# EAGLE design OP-80A (EAGLE 6.6.0)
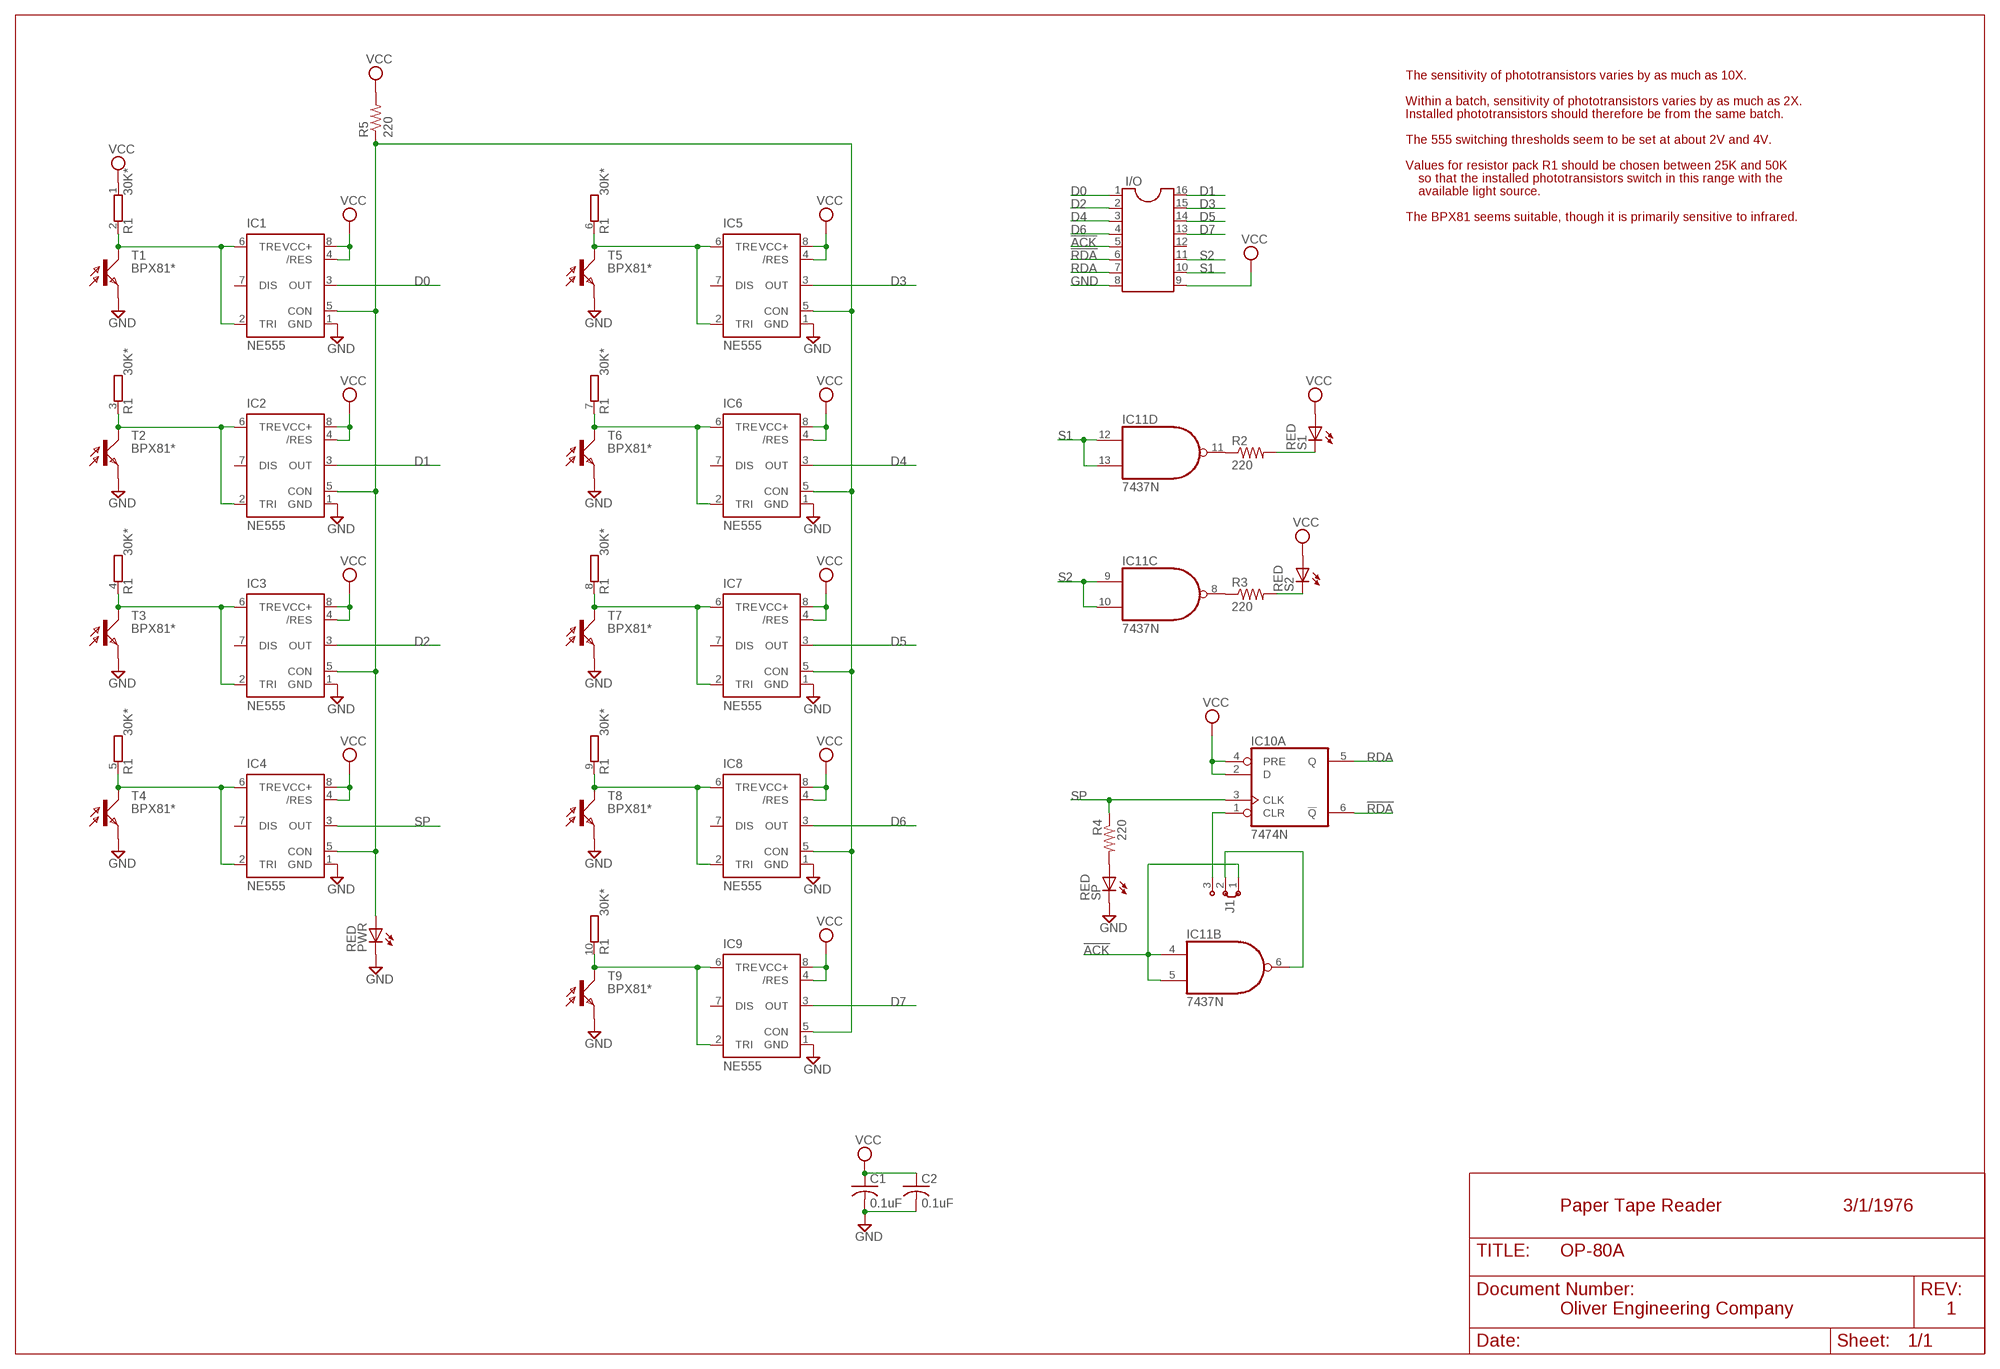
[diagram p0: schematic, sheet 1]

## Parts
C1  0.1uF  C-US050-030X075  [C050-030X075]
C2  0.1uF  C-US050-030X075  [C050-030X075]
I/O  DIL16S  [SOCKET-16]
IC1  NE555  [DIL-08]
IC2  NE555  [DIL-08]
IC3  NE555  [DIL-08]
IC4  NE555  [DIL-08]
IC5  NE555  [DIL-08]
IC6  NE555  [DIL-08]
IC7  NE555  [DIL-08]
IC8  NE555  [DIL-08]
IC9  NE555  [DIL-08]
IC10  7474N  74LS74N  [DIL14]
IC11  7437N  [DIL14]
J1  J2X5MM  [05C]
PWR  RED  LED5MM  [LED5MM]
R1  30K*  GE09RP  [SIL10]
R2  220  R-US_0207/10  [0207/10]
R3  220  R-US_0207/10  [0207/10]
R4  220  R-US_0207/10  [0207/10]
R5  220  R-US_0207/10  [0207/10]
S1  RED  LED5MM  [LED5MM]
S2  RED  LED5MM  [LED5MM]
SP  RED  LED5MM  [LED5MM]
T1  BPX81*  BPX81  [BPX81]
T2  BPX81*  BPX81  [BPX81]
T3  BPX81*  BPX81  [BPX81]
T4  BPX81*  BPX81  [BPX81]
T5  BPX81*  BPX81  [BPX81]
T6  BPX81*  BPX81  [BPX81]
T7  BPX81*  BPX81  [BPX81]
T8  BPX81*  BPX81  [BPX81]
T9  BPX81*  BPX81  [BPX81]

## Nets
!ACK: I/O.5 IC11.4(B:I0) IC11.5(B:I1) J1.1
!RDA: I/O.6 IC10.6(A:!Q)
ACK: IC11.6(B:O) J1.2
D0: I/O.1 IC1.3(OUT)
D1: I/O.16 IC2.3(OUT)
D2: I/O.2 IC3.3(OUT)
D3: I/O.15 IC5.3(OUT)
D4: I/O.3 IC6.3(OUT)
D5: I/O.14 IC7.3(OUT)
D6: I/O.4 IC8.3(OUT)
D7: I/O.13 IC9.3(OUT)
GND [supply]: C1.2 C2.2 I/O.8 IC1.1(GND) IC2.1(GND) IC3.1(GND) IC4.1(GND) IC5.1(GND) IC6.1(GND) IC7.1(GND) IC8.1(GND) IC9.1(GND) PWR.K(C) SP.K(C) T1.E T2.E T3.E T4.E T5.E T6.E T7.E T8.E T9.E
N$1: IC1.2(TRI) IC1.6(TRE) R1.2 T1.C
N$2: R4.2 SP.A
N$3: IC1.5(CON) IC2.5(CON) IC3.5(CON) IC4.5(CON) IC5.5(CON) IC6.5(CON) IC7.5(CON) IC8.5(CON) IC9.5(CON) PWR.A R5.1
N$4: IC2.2(TRI) IC2.6(TRE) R1.3 T2.C
N$7: IC3.2(TRI) IC3.6(TRE) R1.4 T3.C
N$8: IC11.11(D:O) R2.1
N$9: IC9.2(TRI) IC9.6(TRE) R1.10 T9.C
N$10: IC4.2(TRI) IC4.6(TRE) R1.5 T4.C
N$11: IC11.8(C:O) R3.1
N$12: R2.2 S1.K(C)
N$13: IC5.2(TRI) IC5.6(TRE) R1.6 T5.C
N$14: R3.2 S2.K(C)
N$15: IC6.2(TRI) IC6.6(TRE) R1.7 T6.C
N$17: IC7.2(TRI) IC7.6(TRE) R1.8 T7.C
N$19: IC8.2(TRI) IC8.6(TRE) R1.9 T8.C
RDA: I/O.7 IC10.5(A:Q)
S1: I/O.10 IC11.12(D:I0) IC11.13(D:I1)
S2: I/O.11 IC11.9(C:I0) IC11.10(C:I1)
SACK: IC10.1(A:CLR) J1.3
SP: IC4.3(OUT) IC10.3(A:CLK) R4.1
VCC [supply]: C1.1 C2.1 I/O.9 IC1.4(/RES) IC1.8(VCC+) IC2.4(/RES) IC2.8(VCC+) IC3.4(/RES) IC3.8(VCC+) IC4.4(/RES) IC4.8(VCC+) IC5.4(/RES) IC5.8(VCC+) IC6.4(/RES) IC6.8(VCC+) IC7.4(/RES) IC7.8(VCC+) IC8.4(/RES) IC8.8(VCC+) IC9.4(/RES) IC9.8(VCC+) IC10.2(A:D) IC10.4(A:PRE) R1.1 R5.2 S1.A S2.A
Unconnected: I/O.12 IC1.7(DIS) IC2.7(DIS) IC3.7(DIS) IC4.7(DIS) IC5.7(DIS) IC6.7(DIS) IC7.7(DIS) IC8.7(DIS) IC9.7(DIS) IC10.8(B:!Q) IC10.9(B:Q) IC10.10(B:PRE) IC10.11(B:CLK) IC10.12(B:D) IC10.13(B:CLR) IC11.1(A:I0) IC11.2(A:I1) IC11.3(A:O)

## Notes on the sheet
- The sensitivity of phototransistors varies by as much as 10X.
- Within a batch, sensitivity of phototransistors varies by as much as 2X.
- Installed phototransistors should therefore be from the same batch.
- The 555 switching thresholds seem to be set at about 2V and 4V.
- Values for resistor pack R1 should be chosen between 25K and 50K
- so that the installed phototransistors switch in this range with the
- available light source.
- The BPX81 seems suitable, though it is primarily sensitive to infrared.
- Paper Tape Reader | 3/1/1976
- Oliver Engineering Company | 1

## Power pins joined to a net without a drawn wire
GND: IC10.7(P:GND) IC11.7(P:GND)
VCC: IC10.14(P:VCC) IC11.14(P:VCC)

## Library data of the parts
C1 C2 = rcl:C-US: CAPACITOR, American symbol
I/O = ic-package:DIL16: Dual In Line / Socket
IC1-IC9 = st-microelectronics:NE555: General purpose bipolar Timer; MF: Arrow Electronics; MPN: NE555N; OC_FARNELL: 1467742; OC_NEWARK: 89K1486
IC10 = 74xx-eu:74*74: Dual D type positive edge triggered FLIP FLOP, preset and clear
IC11 = 74xx-us:74*37: Quad 2-input NAND buffer
J1 = jumper:J2: Jumper switch 2 x 2.5 mm
PWR S1 S2 SP = led:LED: LED OSRAM: - CHIPLED LG R971, LG N971, LY N971, LG Q971, LY Q971, LO R971, LY R971 LH N974, LH R974 LS Q976, LO Q976, LY Q976 LO Q996 - Hyper CHIPLED LW Q18S LB Q993, LB Q99A, LB R99A - SideLED LS A670, LO A670, LY A670, LG A670, LP A670 LB A673, LV A673, LT A673, LW A673 LH A674 LY A675 LS A676, LA A676, LO A676, LY A676, LW A676 LS A679, LY A679, LG A679 - Hyper Micro SIDELED® LS Y876, LA Y876, LO Y876, LY Y876 LT Y87S - SmartLED LW L88C, LW L88S LB L89C, LB L89S, LG L890 LS L89K, LO L89K, LY L89K LS L896, LA L896, LO L896, LY L896 - TOPLED LS T670, LO T670, LY T670, LG T670, LP T670 LSG T670, LSP T670, LSY T670, LOP T670, LYG T670 LG T671, LOG T671, LSG T671 LB T673, LV T673, LT T673, LW T673 LH T674 LS T676, LA T676, LO T676, LY T676, LB T676, LH T676, LSB T676, LW T676 LB T67C, LV T67C, LT T67C, LS T67K, LO T67K, LY T67K, LW E67C LS E67B, LA E67B, LO E67B, LY E67B, LB E67C, LV E67C, LT E67C LW T67C LS T679, LY T679, LG T679 LS T770, LO T770, LY T770, LG T770, LP T770 LB T773, LV T773, LT T773, LW T773 LH T774 LS E675, LA E675, LY E675, LS T675 LS T776, LA T776, LO T776, LY T776, LB T776 LHGB T686 LT T68C, LB T68C - Hyper Mini TOPLED® LB M676 - Mini TOPLED Santana® LG M470 LS M47K, LO M47K, LY M47K Source: http://www.osram.convergy.de LUXEON: - LUMILED® LXK2-PW12-R00, LXK2-PW12-S00, LXK2-PW14-U00, LXK2-PW14-V00 LXK2-PM12-R00, LXK2-PM12-S00, LXK2-PM14-U00 LXK2-PE12-Q00, LXK2-PE12-R00, LXK2-PE12-S00, LXK2-PE14-T00, LXK2-PE14-U00 LXK2-PB12-K00, LXK2-PB12-L00, LXK2-PB12-M00, LXK2-PB14-N00, LXK2-PB14-P00, LXK2-PB14-Q00 LXK2-PR12-L00, LXK2-PR12-M00, LXK2-PR14-Q00, LXK2-PR14-R00 LXK2-PD12-Q00, LXK2-PD12-R00, LXK2-PD12-S00 LXK2-PH12-R00, LXK2-PH12-S00 LXK2-PL12-P00, LXK2-PL12-Q00, LXK2-PL12-R00 Source: www.luxeon.com KINGBRIGHT: KA-3528ASYC Source: www.kingbright.com
R1 = resistor-sil:GE09RP: SIL RESISTOR; OC_FARNELL: unknown; OC_NEWARK: unknown
R2-R5 = rcl:R-US_: RESISTOR, American symbol
T1-T9 = opto-trans-siemens:BPX81: PHOTO TRANSISTOR; OC_FARNELL: unknown; OC_NEWARK: unknown

## Net classes
1 supply: width 0.61 mm

## Board
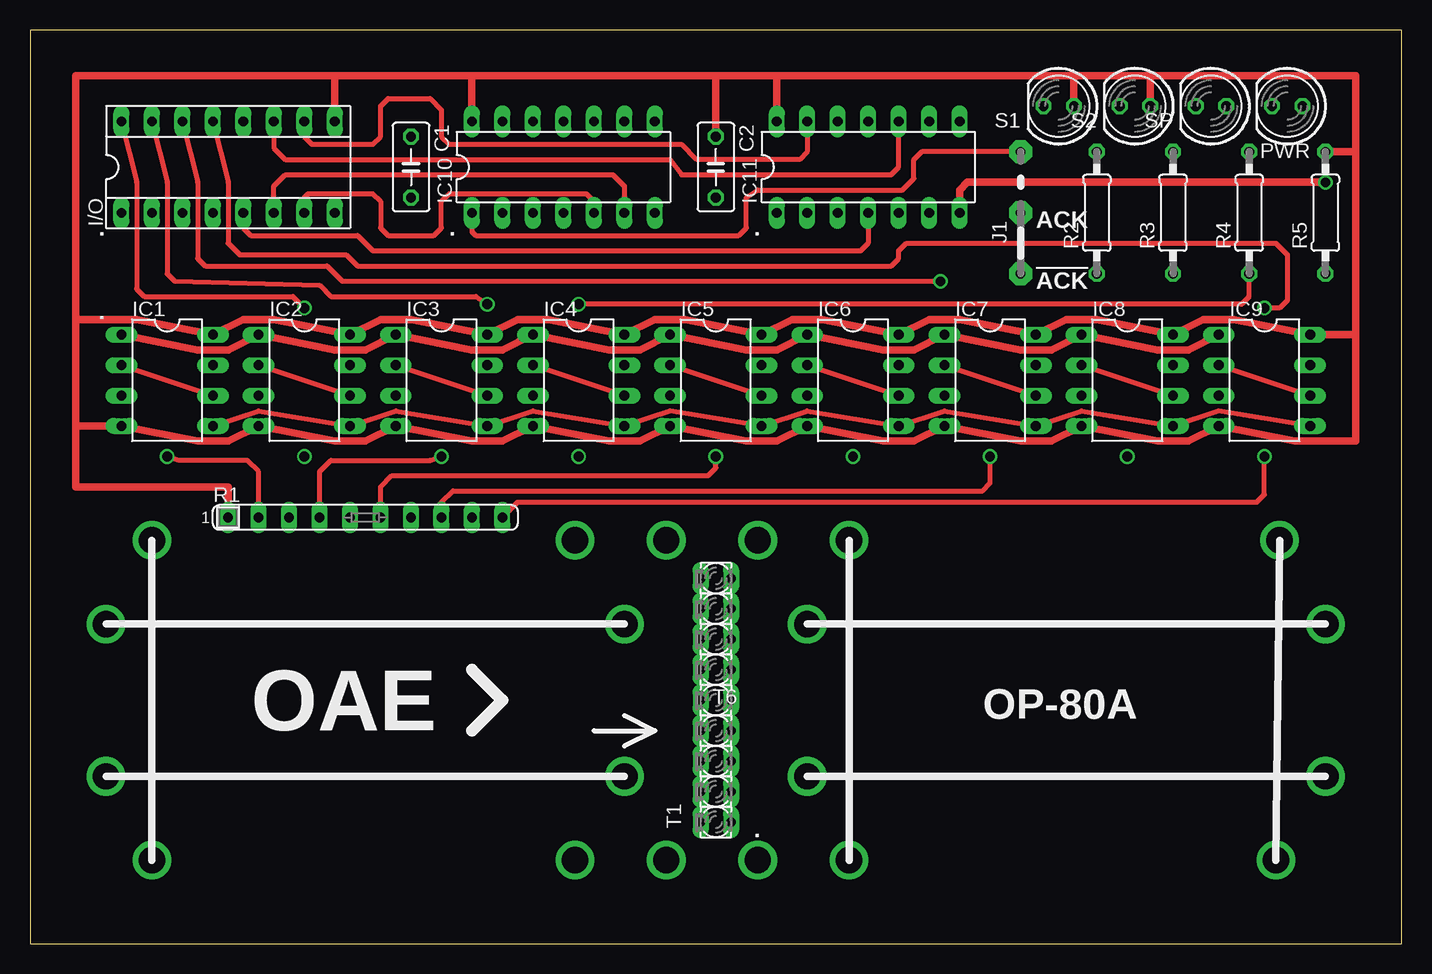
[diagram p1: board, top side]
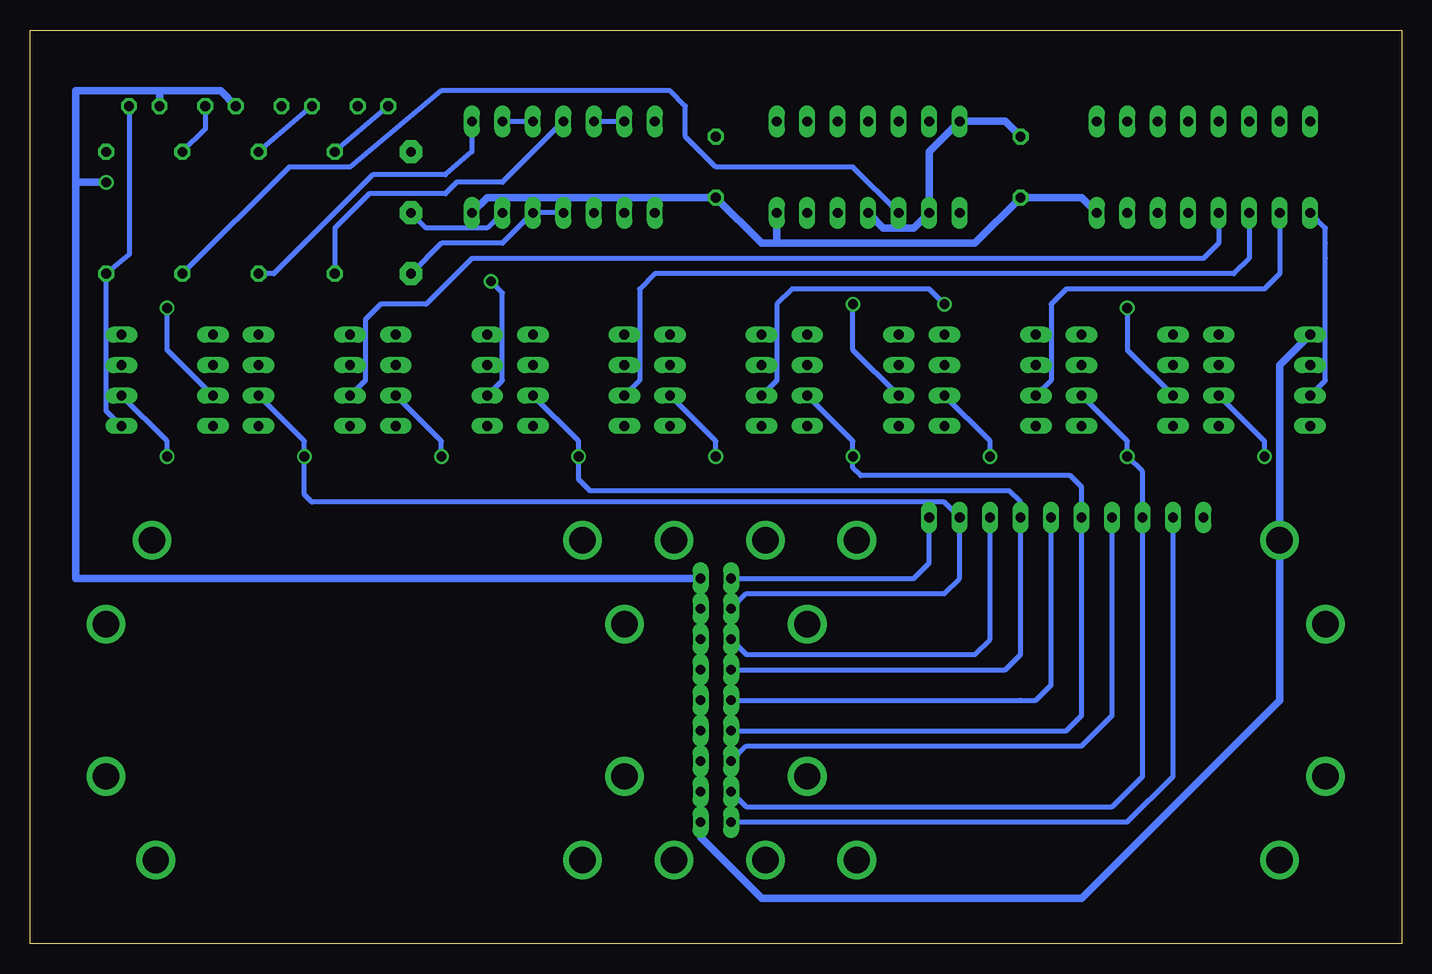
[diagram p2: board, bottom side, seen from below]

Size 114.3 x 76.2 mm. Coordinates in mm from the lower left corner, seen from the top.
Outline: 0,0 114.3,0 114.3,76.2 0,76.2 0,0
Copper layers (1+16): Top 0.035mm / dielectric 1.5mm / Bottom 0.035mm
Design rules "16mils *": minimum track width 16mil, minimum drill 32mil, track to track 15mil, track to pad 10mil, pad to pad 10mil, via to via 10mil, smd to smd 10mil, copper to edge 13mil, drill to drill 10mil, minimum pad ring 10mil, minimum via ring 8mil, stop-mask expansion 0mil, vias tented up to drill 0mil, thermal gap 10mil

### Footprints (pad centres in the part's own frame; a part is rotated, then mirrored left to right if it is on the bottom)
C050-030X075 = drill 0.813 octagon: 1 -2.54,0; 2 2.54,0
SOCKET-16 = drill 0.813 long: 1 -8.89,-3.81; 2 -6.35,-3.81; 3 -3.81,-3.81; 4 -1.27,-3.81; 5 1.27,-3.81; 6 3.81,-3.81; 7 6.35,-3.81; 8 8.89,-3.81; 9 8.89,3.81; 10 6.35,3.81; 11 3.81,3.81; 12 1.27,3.81; 13 -1.27,3.81; 14 -3.81,3.81; 15 -6.35,3.81; 16 -8.89,3.81
DIL-08 = drill 0.813 long: 1 -3.81,-3.81; 2 -1.27,-3.81; 3 1.27,-3.81; 4 3.81,-3.81; 5 3.81,3.81; 6 1.27,3.81; 7 -1.27,3.81; 8 -3.81,3.81
DIL14 = drill 0.813 long: 1 -7.62,-3.81; 2 -5.08,-3.81; 3 -2.54,-3.81; 4 0,-3.81; 5 2.54,-3.81; 6 5.08,-3.81; 7 7.62,-3.81; 8 7.62,3.81; 9 5.08,3.81; 10 2.54,3.81; 11 0,3.81; 12 -2.54,3.81; 13 -5.08,3.81; 14 -7.62,3.81
05C = drill 0.813 pad 1.905 octagon: 1 -2.54,0; 2 2.54,0; 3 7.62,0
LED5MM = drill 0.813 octagon: A -1.27,0; K 1.27,0
SIL10 = drill 0.813 long: 1 -11.43,0; 2 -8.89,0; 3 -6.35,0; 4 -3.81,0; 5 -1.27,0; 6 1.27,0; 7 3.81,0; 8 6.35,0; 9 8.89,0; 10 11.43,0
0207/10 = drill 0.813 octagon: 1 -5.08,0; 2 5.08,0
BPX81 = drill 0.813 long: C 1.27,0; E -1.27,0

### Placement (x,y rotation side)
C1  31.75,64.77 270 top
C2  57.15,64.77 270 top
I/O  16.51,64.77 0 top
IC1  11.43,46.99 270 top
IC2  22.86,46.99 270 top
IC3  34.29,46.99 270 top
IC4  45.72,46.99 270 top
IC5  57.15,46.99 270 top
IC6  68.58,46.99 270 top
IC7  80.01,46.99 270 top
IC8  91.44,46.99 270 top
IC9  102.87,46.99 270 top
IC10  44.45,64.77 0 top
IC11  69.85,64.77 0 top
J1  82.55,58.42 90 top
PWR  104.78,69.85 180 top
R1  27.94,35.56 0 top
R2  88.9,60.96 90 top
R3  95.25,60.96 90 top
R4  101.6,60.96 90 top
R5  107.95,60.96 90 top
S1  85.72,69.85 180 top
S2  92.08,69.85 180 top
SP  98.42,69.85 180 top
T1  57.15,10.16 180 top
T2  57.15,12.7 180 top
T3  57.15,15.24 180 top
T4  57.15,17.78 180 top
T5  57.15,20.32 180 top
T6  57.15,22.86 180 top
T7  57.15,25.4 180 top
T8  57.15,27.94 180 top
T9  57.15,30.48 180 top

### Tracks (layer width: path | path; a pad name or v marks a point on that pad's centre or on a via)
!ACK
  Top 0.406: I/O.5 17.78,59.69 18.41,59.05 27.3,59.05 28.57,57.78 69.22,57.78 69.85,58.42 IC11.4
  Bottom 0.406: IC11.4 IC11.5 74.93,58.42 80.01,58.42 J1.1
!RDA
  Top 0.406: I/O.6 20.32,63.18 21.27,64.14 48.58,64.14 49.53,63.18 IC10.6
ACK
  Bottom 0.406: IC11.6 76.2,59.69 81.28,59.69 J1.2
D0
  Bottom 0.406: IC1.3 6.35,46.99 6.35,57.15 6.35,58.42 6.35,59.69 I/O.1
D1  (via drill 0.81)
  Top 0.406: I/O.16 8.89,63.5 8.89,54.61 9.53,53.98 21.91,53.98 v22.86,53.02
  Bottom 0.406: IC2.3 22.86,49.53 v22.86,53.02
D2
  Bottom 0.406: I/O.2 10.16,55.88 11.43,54.61 27.94,54.61 29.21,53.34 29.21,46.99 IC3.3
D3  (via drill 0.81)
  Top 0.406: I/O.15 11.43,63.5 11.43,55.88 12.06,55.24 24.13,54.93 25.08,53.98 37.15,53.98 v38.1,53.34
  Bottom 0.406: v38.1,53.34 39.37,54.61 50.8,54.61 52.07,53.34 52.07,46.99 IC5.3
D4
  Bottom 0.406: I/O.3 12.7,57.15 13.97,55.88 62.23,55.88 63.5,54.61 63.5,46.99 IC6.3
D5  (via drill 0.81)
  Top 0.406: I/O.14 13.97,63.5 13.97,57.15 14.61,56.52 24.77,56.52 26.04,55.24 v75.88,55.24
  Bottom 0.406: IC7.3 74.93,46.99 74.93,54.29 v75.88,55.24
D6
  Bottom 0.406: I/O.4 15.24,58.42 16.51,57.15 77.47,57.15 81.28,53.34 85.09,53.34 86.36,52.07 86.36,46.99 IC8.3
D7  (via drill 0.81)
  Top 0.406: I/O.13 16.51,63.5 16.51,58.42 17.46,57.47 26.35,57.47 27.3,56.52 71.75,56.52 72.39,57.15 72.39,57.78 73.03,58.42 103.82,58.42 104.78,57.47 104.78,53.66 104.14,53.02 v102.87,53.02
  Bottom 0.406: IC9.3 102.87,49.53 v102.87,53.02
GND  (via drill 0.81, 2.2)
  Top 0.61: IC1.1 13.97,49.53 16.51,49.53 IC2.1 25.4,49.53 27.94,49.53 IC3.1 36.83,49.53 39.37,49.53 IC4.1 48.26,49.53 50.8,49.53 IC5.1 59.69,49.53 62.23,49.53 IC6.1 71.12,49.53 73.66,49.53 IC7.1 82.55,49.53 85.09,49.53 IC8.1 93.98,49.53 96.52,49.53 IC9.1 | IC11.7 77.47,62.87 78.11,63.5 v107.95,63.5
  Bottom 0.61: I/O.8 26.67,62.23 C1.2 35.56,58.42 52.07,58.42 | IC10.7 52.07,58.42 | 52.07,58.42 53.34,58.42 C2.2 76.2,62.23 IC11.7 | SP.K 98.42,71.12 103.5,71.12 | 103.5,71.12 PWR.K | 103.5,71.12 110.49,71.12 110.49,63.5 | 110.49,63.5 110.49,30.48 T9.E T8.E T7.E T6.E T5.E T4.E T3.E T2.E T1.E 58.42,8.89 53.34,3.81 26.67,3.81 10.16,20.32 v10.16,33.66 10.16,48.26 IC1.1 | v107.95,63.5 110.49,63.5
N$1  (via drill 0.81)
  Top 0.406: IC1.2 IC1.6 | R1.2 19.05,39.37 18.1,40.32 12.38,40.32 v11.43,40.64
  Bottom 0.406: IC1.6 11.43,41.91 v11.43,40.64 | T1.C 22.86,10.16 19.05,13.97 R1.2
N$2
  Bottom 0.406: SP.A 99.69,67.94 R4.2
N$3
  Top 0.406: IC9.5 99.06,44.45 IC8.5 87.63,44.45 IC7.5 76.2,44.45 IC6.5 64.77,44.45 IC5.5 53.34,44.45 IC4.5 41.91,44.45 IC3.5 30.48,44.45 IC2.5 19.05,44.45 IC1.5
  Bottom 0.406: PWR.A 106.05,57.47 R5.1 107.95,44.45 IC9.5
N$4  (via drill 0.81)
  Top 0.406: IC2.2 IC2.6
  Bottom 0.406: IC2.6 22.86,41.91 v22.86,40.64 21.59,39.37 R1.3 21.59,13.97 24.13,11.43 54.61,11.43 T2.C
N$6  (via drill 2.2)
  other vias: 6.35,26.67
N$7  (via drill 0.81)
  Top 0.406: IC3.2 IC3.6 | R1.4 24.13,39.37 25.08,40.32 33.34,40.32 v34.29,40.64
  Bottom 0.406: v34.29,40.64 34.29,41.91 IC3.6 | T3.C 54.61,16.51 27.94,16.51 26.67,16.51 24.13,19.05 24.13,20.32 R1.4
N$8
  Bottom 0.406: IC11.11 74.93,63.5 78.74,63.5 79.69,62.55 86.04,62.55 88.9,59.69 R2.1
N$9  (via drill 0.81)
  Top 0.406: IC9.2 IC9.6 | R1.10 40.64,36.83 102.23,36.83 102.87,37.47 v102.87,40.64
  Bottom 0.406: v102.87,40.64 102.87,41.91 IC9.6 | T9.C 40.64,30.48 39.37,31.75 R1.10
N$10  (via drill 0.81)
  Top 0.406: IC4.6 IC4.2
  Bottom 0.406: IC4.6 45.72,41.91 v45.72,40.64 45.72,39.69 45.09,39.05 27.62,39.05 26.67,38.1 R1.5 26.67,19.05 27.94,17.78 T4.C
N$11
  Bottom 0.406: IC11.8 77.47,66.04 79.69,64.14 85.72,64.14 93.98,55.88 R3.1
N$12
  Bottom 0.406: S1.K R2.2
N$13  (via drill 0.81)
  Top 0.406: IC5.2 IC5.6 | R1.6 29.21,38.1 30.16,39.05 56.52,39.05 57.15,39.69 v57.15,40.64
  Bottom 0.406: v57.15,40.64 57.15,41.91 IC5.6 | T5.C 31.75,20.32 30.48,20.32 29.21,21.59 29.21,22.86 R1.6
N$14
  Bottom 0.406: S2.K R3.2
N$15  (via drill 0.81)
  Top 0.406: IC6.2 IC6.6
  Bottom 0.406: IC6.6 68.58,41.91 v68.58,40.64 68.58,38.73 67.63,37.78 32.7,37.78 31.75,36.83 R1.7 31.75,24.13 33.02,22.86 T6.C
N$16  (via drill 2.2)
  other vias: 6.35,13.97
N$17  (via drill 0.81)
  Top 0.406: IC7.2 IC7.6 | R1.8 34.29,36.83 35.24,37.78 79.38,37.78 80.01,38.42 v80.01,40.64
  Bottom 0.406: v80.01,40.64 80.01,41.91 IC7.6 | T7.C 54.61,24.13 35.56,24.13 34.29,25.4 R1.8
N$18  (via drill 2.2)
  other vias: 45.4,33.66
N$19  (via drill 0.81)
  Top 0.406: IC8.2 IC8.6
  Bottom 0.406: IC8.6 91.44,41.91 v91.44,40.64 91.44,37.47 90.81,36.83 38.1,36.83 R1.9 36.83,30.48 38.1,29.21 54.61,29.21 T8.C
N$20  (via drill 2.2)
  other vias: 53.02,33.66
N$21  (via drill 2.2)
  other vias: 60.64,33.66
N$22  (via drill 2.2)
  other vias: 68.26,33.66
N$23  (via drill 2.2)
  other vias: 49.53,26.67
N$24  (via drill 2.2)
  other vias: 64.77,26.67
N$25  (via drill 2.2)
  other vias: 64.77,13.97
N$26  (via drill 2.2)
  other vias: 49.53,13.97
N$27  (via drill 2.2)
  other vias: 10.16,6.99
N$28  (via drill 2.2)
  other vias: 45.4,6.99
N$29  (via drill 2.2)
  other vias: 53.02,6.99
N$30  (via drill 2.2)
  other vias: 68.26,6.99
N$31  (via drill 2.2)
  other vias: 60.64,6.99
N$32  (via drill 2.2)
  other vias: 103.82,6.99
N$33  (via drill 2.2)
  other vias: 104.14,33.66
N$34  (via drill 2.2)
  other vias: 107.95,26.67
N$35  (via drill 2.2)
  other vias: 107.95,13.97
RDA
  Top 0.406: I/O.7 22.86,62.23 23.18,62.55 28.57,62.55 29.21,61.91 29.21,59.69 29.84,59.05 33.66,59.05 34.29,59.69 34.29,61.91 34.92,62.55 46.35,62.55 46.99,61.91 IC10.5
S1
  Top 0.406: I/O.10 22.86,67.31 23.5,66.67 28.57,66.67 29.21,67.31 29.21,69.85 29.84,70.48 33.34,70.48 34.29,69.53 34.29,67.31 34.92,66.67 54.29,66.67 55.56,65.41 64.14,65.41 64.77,66.04 IC11.13
  Bottom 0.406: IC11.12 IC11.13
S2
  Top 0.406: I/O.11 20.32,66.36 21.27,65.41 53.34,65.41 54.29,64.14 71.75,64.14 72.39,64.77 IC11.10
  Bottom 0.406: IC11.9 IC11.10
SACK
  Top 0.406: IC10.1 36.83,59.37 37.15,59.05 59.05,59.05 59.69,59.69 59.69,62.23 60.64,62.87 72.71,62.87 73.66,63.82 73.66,65.41 74.3,66.04 J1.3
SP  (via drill 0.81)
  Top 0.406: v45.72,53.34 100.97,53.34 101.6,53.98 R4.1
  Bottom 0.406: IC4.3 45.72,49.53 v45.72,53.34 | IC10.3 45.72,64.77 57.15,64.77 59.69,67.31 59.69,69.85 60.96,71.12 80.01,71.12 87.63,64.77 92.71,64.77 R4.1
VCC
  Top 0.61: R1.1 16.51,38.1 3.81,38.1 3.81,43.18 | 3.81,43.18 IC1.4 13.97,41.91 16.51,41.91 IC2.4 25.4,41.91 27.94,41.91 IC3.4 36.83,41.91 39.37,41.91 IC4.4 48.26,41.91 50.8,41.91 IC5.4 59.69,41.91 62.23,41.91 IC6.4 71.12,41.91 73.66,41.91 IC7.4 82.55,41.91 85.09,41.91 IC8.4 93.98,41.91 96.52,41.91 IC9.4 105.41,41.91 110.49,41.91 110.49,50.8 | 3.81,52.07 8.89,52.07 IC1.8 17.78,52.07 20.32,52.07 IC2.8 29.21,52.07 31.75,52.07 IC3.8 40.64,52.07 43.18,52.07 IC4.8 52.07,52.07 54.61,52.07 IC5.8 63.5,52.07 66.04,52.07 IC6.8 74.93,52.07 77.47,52.07 IC7.8 86.36,52.07 88.9,52.07 IC8.8 97.79,52.07 100.33,52.07 IC9.8 110.49,50.8 | 3.81,52.07 3.81,43.18 | I/O.9 25.4,72.39 | 25.4,72.39 3.81,72.39 3.81,52.07 | IC10.14 36.83,72.39 | 36.83,72.39 25.4,72.39 | C2.1 57.15,72.39 | 57.15,72.39 36.83,72.39 | IC11.14 62.23,72.39 | 62.23,72.39 57.15,72.39 | R5.2 110.49,66.04 | 110.49,66.04 110.49,72.39 93.34,72.39 | 93.34,72.39 87,72.39 | 87,72.39 62.23,72.39 | 110.49,50.8 110.49,66.04 | S1.A 87,72.39 | S2.A 93.34,72.39
  Bottom 0.61: C1.1 33.02,68.58 IC10.14 39.37,66.04 IC10.2 40.64,59.69 43.18,59.69 IC10.4

### Text on the board
tPlace: ACK | . | . | . | !ACK | . | OP-80A | OAE | .